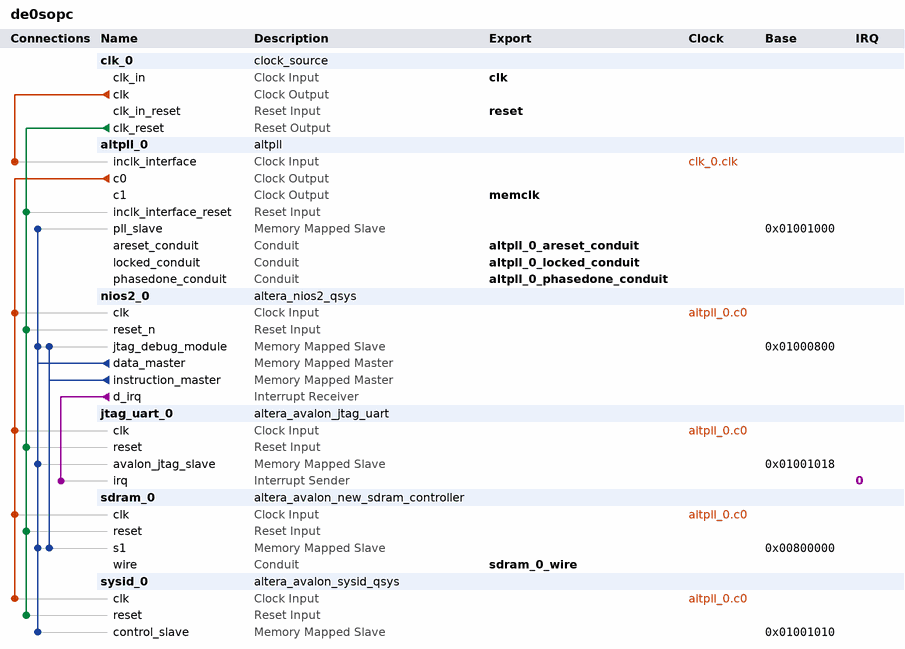
[diagram p0: system contents]
# Platform Designer (Qsys) system de0sopc, Cyclone III EP3C16F484C6
# Parameters at their usual value, and those the tool derives, are not listed.
package require -exact qsys 13.0
create_system de0sopc
set_project_property DEVICE_FAMILY {Cyclone III}
set_project_property DEVICE EP3C16F484C6

add_instance clk_0 clock_source 13.0
set_instance_parameter_value clk_0 clockFrequency 50000000

add_instance altpll_0 altpll 13.0
set_instance_parameter_value altpll_0 INCLK0_INPUT_FREQUENCY 20000
set_instance_parameter_value altpll_0 CLK0_MULTIPLY_BY 2
set_instance_parameter_value altpll_0 CLK1_MULTIPLY_BY 2
set_instance_parameter_value altpll_0 CLK0_DIVIDE_BY 1
set_instance_parameter_value altpll_0 CLK1_DIVIDE_BY 1
set_instance_parameter_value altpll_0 CLK1_PHASE_SHIFT -2500
set_instance_parameter_value altpll_0 CLK1_DUTY_CYCLE 50
set_instance_parameter_value altpll_0 PORT_clk1 PORT_USED
set_instance_parameter_value altpll_0 PORT_clk2 PORT_UNUSED
set_instance_parameter_value altpll_0 PORT_clk3 PORT_UNUSED
set_instance_parameter_value altpll_0 PORT_ARESET PORT_UNUSED
set_instance_parameter_value altpll_0 PORT_LOCKED PORT_UNUSED

add_instance nios2_0 altera_nios2_qsys 13.0
set_instance_parameter_value nios2_0 resetSlave sdram_0.s1
set_instance_parameter_value nios2_0 mmu_TLBMissExcSlave None
set_instance_parameter_value nios2_0 exceptionSlave sdram_0.s1
set_instance_parameter_value nios2_0 breakSlave nios2_0.jtag_debug_module
set_instance_parameter_value nios2_0 impl Tiny
set_instance_parameter_value nios2_0 icache_size 4096

add_instance jtag_uart_0 altera_avalon_jtag_uart 13.0.1.99.2
set_instance_parameter_value jtag_uart_0 simInteractiveOptions NO_INTERACTIVE_WINDOWS
set_instance_parameter_value jtag_uart_0 useRegistersForReadBuffer true
set_instance_parameter_value jtag_uart_0 useRegistersForWriteBuffer true

add_instance sdram_0 altera_avalon_new_sdram_controller 13.0.1.99.2
set_instance_parameter_value sdram_0 TAC 5.5
set_instance_parameter_value sdram_0 TRCD 20.0
set_instance_parameter_value sdram_0 TRP 20.0
set_instance_parameter_value sdram_0 casLatency 3
set_instance_parameter_value sdram_0 columnWidth 8
set_instance_parameter_value sdram_0 dataWidth 16
set_instance_parameter_value sdram_0 generateSimulationModel false
set_instance_parameter_value sdram_0 model single_Micron_MT48LC4M32B2_7_chip
set_instance_parameter_value sdram_0 numberOfBanks 4
set_instance_parameter_value sdram_0 numberOfChipSelects 1
set_instance_parameter_value sdram_0 powerUpDelay 200.0
set_instance_parameter_value sdram_0 refreshPeriod 7.8125
set_instance_parameter_value sdram_0 rowWidth 12

add_instance sysid_0 altera_avalon_sysid_qsys 13.0
set_instance_parameter_value sysid_0 id 0

# connections
add_connection altpll_0.c0 jtag_uart_0.clk clock
add_connection altpll_0.c0 nios2_0.clk clock
add_connection altpll_0.c0 sdram_0.clk clock
add_connection altpll_0.c0 sysid_0.clk clock
add_connection clk_0.clk altpll_0.inclk_interface clock
add_connection clk_0.clk_reset altpll_0.inclk_interface_reset reset
add_connection clk_0.clk_reset jtag_uart_0.reset reset
add_connection clk_0.clk_reset nios2_0.reset_n reset
add_connection clk_0.clk_reset sdram_0.reset reset
add_connection clk_0.clk_reset sysid_0.reset reset
add_connection nios2_0.data_master altpll_0.pll_slave avalon
set_connection_parameter_value nios2_0.data_master/altpll_0.pll_slave baseAddress 0x01001000
add_connection nios2_0.data_master jtag_uart_0.avalon_jtag_slave avalon
set_connection_parameter_value nios2_0.data_master/jtag_uart_0.avalon_jtag_slave baseAddress 0x01001018
add_connection nios2_0.data_master nios2_0.jtag_debug_module avalon
set_connection_parameter_value nios2_0.data_master/nios2_0.jtag_debug_module baseAddress 0x01000800
add_connection nios2_0.data_master sdram_0.s1 avalon
set_connection_parameter_value nios2_0.data_master/sdram_0.s1 baseAddress 0x00800000
add_connection nios2_0.data_master sysid_0.control_slave avalon
set_connection_parameter_value nios2_0.data_master/sysid_0.control_slave baseAddress 0x01001010
add_connection nios2_0.instruction_master nios2_0.jtag_debug_module avalon
set_connection_parameter_value nios2_0.instruction_master/nios2_0.jtag_debug_module baseAddress 0x01000800
add_connection nios2_0.instruction_master sdram_0.s1 avalon
set_connection_parameter_value nios2_0.instruction_master/sdram_0.s1 baseAddress 0x00800000
add_connection nios2_0.d_irq jtag_uart_0.irq interrupt
set_connection_parameter_value nios2_0.d_irq/jtag_uart_0.irq irqNumber 0

# exported interfaces
add_interface clk clock sink
set_interface_property clk EXPORT_OF clk_0.clk_in
add_interface reset reset sink
set_interface_property reset EXPORT_OF clk_0.clk_in_reset
add_interface sdram_0_wire conduit end
set_interface_property sdram_0_wire EXPORT_OF sdram_0.wire
add_interface altpll_0_phasedone_conduit conduit end
set_interface_property altpll_0_phasedone_conduit EXPORT_OF altpll_0.phasedone_conduit
add_interface altpll_0_locked_conduit conduit end
set_interface_property altpll_0_locked_conduit EXPORT_OF altpll_0.locked_conduit
add_interface altpll_0_areset_conduit conduit end
set_interface_property altpll_0_areset_conduit EXPORT_OF altpll_0.areset_conduit
add_interface memclk clock source
set_interface_property memclk EXPORT_OF altpll_0.c1

set_interconnect_requirement {$system} qsys_mm.clockCrossingAdapter HANDSHAKE
set_interconnect_requirement {$system} qsys_mm.maxAdditionalLatency 1

save_system de0sopc.qsys
